# Altium schematic sheet stm32-lora.SchDoc
size A4
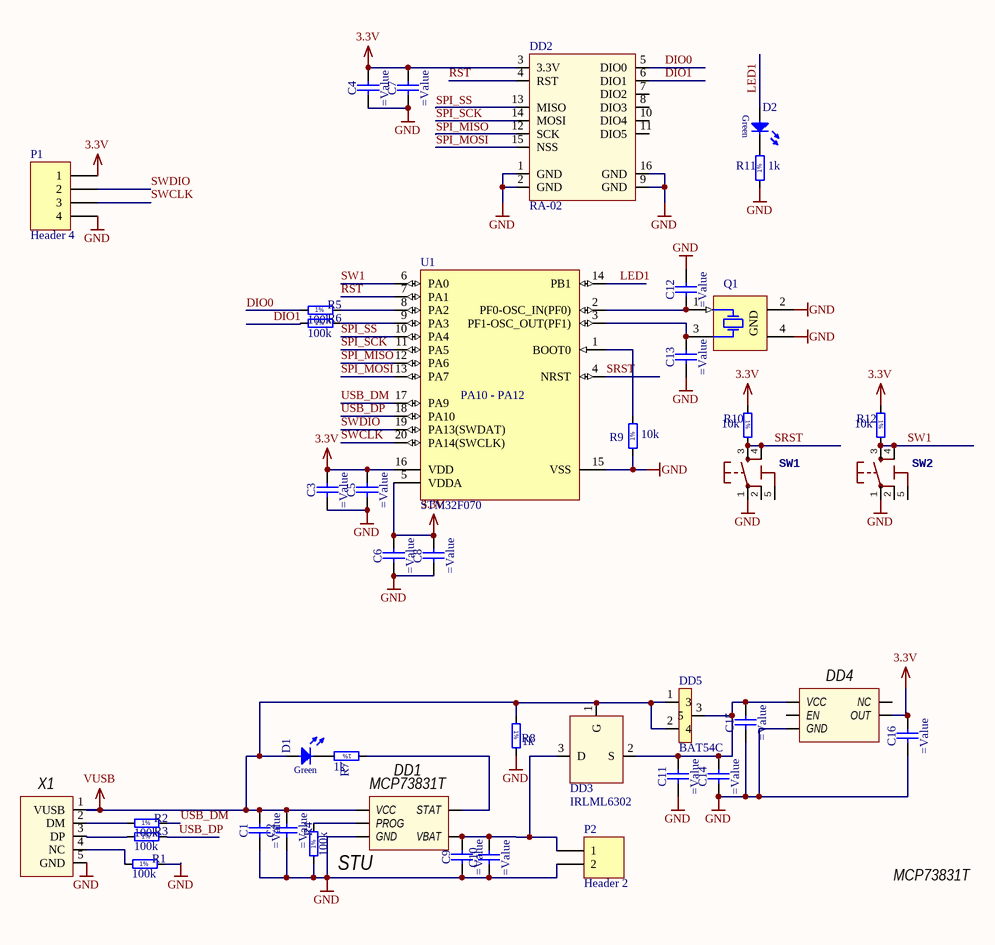
[diagram p0: stm32-lora.SchDoc]

## Parts
C1  (no value)  [CAPC2012X135N]
C2  (no value)  [CAPC1608X85N]
C3  (no value)  [CAPC1608X85N]
C4  (no value)  [CAPC1608X85N]
C5  (no value)  [CAPC1608X85N]
C6  (no value)  [CAPC1608X85N]
C7  (no value)  [CAPC1608X85N]
C8  (no value)  [CAPC1608X85N]
C9  (no value)  [CAPC1608X85N]
C10  (no value)  [CAPC2012X135N]
C11  (no value)  [CAPC2012X135N]
C12  (no value)  [CAPC1608X85N]
C13  (no value)  [CAPC1608X85N]
C14  (no value)  [CAPC2012X135N]
C15  (no value)  [CAPC1608X85N]
C16  (no value)  [CAPC1608X85N]
D1  Green  [LED_OSRAM_LGL29K]  (value not drawn)
D2  Green  [LED_OSRAM_LGL29K]  (value not drawn)
DD1  MCP73831T  [SOT95P270X145-5N]
DD2  RA-02  [ESP_12 - duplicate]
DD3  IRLML6302  [SOT95P245X110-3N]
DD4  MCP73831T  [SOT95P270X145-5N]
DD5  BAT54C  [SOT95P245X110-3N]
P1  Header 4  [HDR1X4]
P2  Header 2  [HDR1X2]
Q1  114.285MHZ  [XTAL_CONNOR_CS]  (value not drawn)
R1  100k  [RESC1608X55N]
R2  100k  [RESC1608X55N]
R3  100k  [RESC1608X55N]
R4  100k  [RESC1608X55N]
R5  100k  [RESC1608X55N]
R6  100k  [RESC1608X55N]
R7  1k  [RESC1608X55N]
R8  1k  [RESC1608X55N]
R9  10k  [RESC1608X55N]
R10  10k  [RESC1608X55N]
R11  1k  [RESC1608X55N]
R12  10k  [RESC1608X55N]
SW1  TS42 Dongnan Electronics Tact switch VDC 12V - 50mA  [TS42]  (value not drawn)
SW2  TS42 Dongnan Electronics Tact switch VDC 12V - 50mA  [TS42]  (value not drawn)
U1  STM32F070  [SOP127P600-8N]
X1  uUSB  [USB-MICROB]  (value not drawn)

## Nets
3.3V: C3.2 C4.2 C5.2 C6.2 C7.2 C8.2 C16.2 DD2.3(3.3V) DD4.5(OUT) P1.1 R10.1 R12.1 U1.5(VDDA) U1.16(VDD)
GND: C1.1 C2.1 C3.1 C4.1 C5.1 C6.1 C7.1 C8.1 C9.1 C10.1 C11.1 C12.2 C13.1 C14.1 C15.1 C16.1 DD1.2(GND) DD2.1(GND) DD2.2(GND) DD2.9(GND) DD2.16(GND) DD4.2(GND) P1.4 P2.2 Q1.2(GND) Q1.4(GND) R1.2 R4.1 R8.2 R9.1 R11.1 SW1.1 SW2.1 U1.15(VSS) X1.5(GND)
VUSB: C1.2 C2.2 D1.2(A) DD1.4(VCC) DD3.1(G) DD5.1(3) DD5.2(4) R8.1 X1.1(VUSB)
DIO0: DD2.5(DIO0) R5.1
DIO1: DD2.6(DIO1) R6.1
LED1: D2.2(A) U1.14(PB1)
RST: DD2.4(RST) U1.7(PA1)
SPI_MISO: DD2.12(SCK) U1.12(PA6)
SPI_MOSI: DD2.15(NSS) U1.13(PA7)
SPI_SCK: DD2.14(MOSI) U1.11(PA5)
SPI_SS: DD2.13(MISO) U1.10(PA4)
SRST: R10.2 SW1.3 SW1.4 U1.4(NRST)
SW1: R12.2 SW2.3 SW2.4 U1.6(PA0)
SWCLK: P1.3 U1.20(PA14(SWCLK))
SWDIO: P1.2 U1.19(PA13(SWDAT))
USB_DM: R2.2 U1.17(PA9)
USB_DP: R3.2 U1.18(PA10)
NetC9_2: C9.2 C10.2 DD1.3(VBAT) DD3.3(D) P2.1
NetC11_2: C11.2 C14.2 C15.2 DD3.2(S) DD4.4(NC) DD5.3(5)
NetC12_1: C12.1 Q1.1(X) U1.2(PF0-OSC_IN(PF0))
NetC13_2: C13.2 Q1.3(X) U1.3(PF1-OSC_OUT(PF1))
NetD1_1: D1.1(C) R7.2
NetD2_1: D2.1(C) R11.2
NetDD1_1: DD1.1(STAT) R7.1
NetDD1_5: DD1.5(PROG) R4.2
NetR1_1: R1.1 X1.4(NC)
NetR2_1: R2.1 X1.2(DM)
NetR3_1: R3.1 X1.3(DP)
NetR5_2: R5.2 U1.8(PA2)
NetR6_2: R6.2 U1.9(PA3)
NetR9_2: R9.2 U1.1(BOOT0)

Not connected (* = marked no-connect by the designer): DD2 7(DIO2) 8(DIO3) 10(DIO4) 11(DIO5); DD4 3(EN); SW1 2 5(5-GND); SW2 2 5(5-GND)

## Notes on the sheet
- (near U1) PA10 - PA12
- (in symbol MCP73831T) STU
- (in symbol R0603_2K7_1%_0.1W_100PPM) 1%

## Library data of the parts
C1 C10 C11 C14 = CC0805_1NF_50V_5%_X7R: Non-polarised capacitor; Part Number: CC0805_1NF_50V_5%_X7R
C2-C9 C12 C13 C15 C16 = CPPS0603_2.2NF_16V_5%_PANASONIC_ECHU(X): Non-polarised capacitor; Part Number: CPPS0603_2.2NF_16V_5%_PANASONIC_ECHU(X)
D1 D2 = LED_OSRAM_LG L29K-G2J1-24-Z: LED Green 1C 2A; Part Description: Surface Mount Green LED (0603 Case); Manufacturer: OSRAM; Table: LEDs & Displays; Part Number: LED_OSRAM_LG L29K-G2J1-24-Z; Component Kind: Standard; Component Type: Standard; Color: Green; PackageDescription: Green Chip LED, 2-Leads, Body 1.7x0.8mm, IPC Medium Density; Manufacturer Part Number: LG L29K-G2J1-24-Z; Pin Count: 2; Case: 0603; Mounted: Yes; Socket: No; SMD: Yes; ComponentHeight: 0.67mm; HelpURL: \\cern.ch\dfs\Applications\Altium\Datasheets\LED_OSRAM_LGL29K.pdf; Author: CERN DEM JLC; CreateDate: 24.04.2012; LatestRevisionDate: 24.04.2012
DD1 = MCP73831T: MCP73831T Li-ion/Li-po charger; Manufacter: Microchip; Part Number: MCP73831/2  SOT-23-5
DD4 = MIC5504: MCP73831T Li-ion/Li-po charger; Manufacter: Microchip; Part Number: MCP73831/2  SOT-23-5
P1 = Header 4: Header, 4-Pin; LatestRevisionDate: 17-Jul-2002; LatestRevisionNote: Re-released for DXP Platform.; Publisher: Altium Limited
P2 = Header 2: Header, 2-Pin; LatestRevisionDate: 17-Jul-2002; LatestRevisionNote: Re-released for DXP Platform.; Publisher: Altium Limited
Q1 = XTAL_114.285MHZ_CONNOR_CS-018: Crystal 4 pins 1=XTAL Control 2=GND3=XTAL 4=GND; Part Description: ±100ppm 18pF -40°C to +85°C  4 Pins, 3.2x2.5X0.8mm, SMD Crystal Unit, CS-018 Serie; Manufacturer: CONNOR WINFIELD; Manufacturer Part Number: CS-018-114.285M; Table: Crystals & Oscillators; Part Number: XTAL_114.285MHZ_CONNOR_CS-018; Component Kind: Standard; Component Type: Standard; PackageDescription: 4 Pins, 2.5x3.2mm, SMD Sealing Crystal, CS Serie; Value: 114.285MHZ; Pin Count: 4; Mounted: Yes; Socket: No; SMD: Yes; ComponentHeight: 0.8mm; HelpURL: \\cern.ch\dfs\Applications\Altium\Datasheets\XTAL_CONNOR_CS-018.pdf; Author: CERN DEM JLC; CreateDate: 16.04.2013; LatestRevisionDate: 08.07.2014
R1-R6 = R0603_2K7_1%_0.1W_100PPM: Resistor - 1%; Part Number: R0603_2K7_1%_0.1W_100PPM
R7-R12 = R0603_2K7_1%_0.1W_100PPM: Resistor - 1%; Part Description: General Purpose Thick Film Chip Resistor; Manufacturer: GENERIC; Manufacturer1 Part Number: RC0603FR-072K7L; Power: 0.1W; TC: ±100ppm/°C; Table: Resistors SMD; Part Number: R0603_2K7_1%_0.1W_100PPM; Component Kind: Standard; Component Type: Standard; Pin Count: 2; Status: Preferred; Tolerance: ±1%; Manufacturer Part Number: R0603_2K7_1%_0.1W_100PPM; Case: 0603; Mounted: Yes; Socket: No; SMD: Yes; Manufacturer1 Example: YAGEO PHYCOMP; Manufacturer1 ComponentHeight: 0.55mm; HelpURL: \\cern.ch\dfs\Applications\Altium\Datasheets\R0603_PHYCOMP_RC0603.pdf; Author: CERN DEM JLC; CreateDate: 02.05.2011; LatestRevisionDate: 02.05.2011
  R7 R8 R11: Value: 1k
  R9 R10 R12: Value: 10k
SW1 SW2 = TS42
U1 = STM32F070F4P6: ARM Cortex-M0 32-bit MCU, 32 KB Flash, 4 KB Internal RAM, 15 I/Os, 20-pin TSSOP, -40 to 85 degC, Tube; PartNumber: STM32F050F6P6; FLASH Size (Prog) (kB): 32; I/Os (High Current): 15; Internal RAM Size (kB): 4; Operating Frequency(F) (Processor speed) (MHz): 48; Supply Voltage(Vcc) min (V): 2; DatasheetVersion: Rev. 1; PackageVersion: Rev. 1, 11/2012; PackageReference: TSSOP20; PackageDescription: 20-Pin Thin Shrink Small Outline Package, 6.5 x 4.4 mm Body, 0.65 mm Pitch; Supplier 1: Digi-Key; Supplier Part Number 1: STM32F050F6P6-ND; Supplier 2: Farnell; Supplier Part Number 2: 2333136; Supplier 3: Newark; Supplier Part Number 3: 99W9749; Supplier 4: Newark; Supplier Part Number 4: 89W1489; Supplier 5: Mouser; Supplier Part Number 5: 511-STM32F050F6P6; Core: ARM Cortex-M0; Packing: Tube; Mounting Technology: Surface Mount; ComponentLink1Description: Manufacturer URL; ComponentLink1URL: http://www.st.com/web/en/home.html; ComponentLink2Description: Datasheet; ComponentLink2URL: http://www.st.com/st-web-ui/static/active/en/resource/technical/document/datasheet/DM00065136.pdf; ComponentLink3Description: Package Specification; ComponentLink3URL: http://www.st.com/st-web-ui/static/active/en/resource/technical/document/datasheet/DM00065136.pdf; Supplier 6: Farnell; Supplier Part Number 6: 2488284
X1 = usb: micro USB